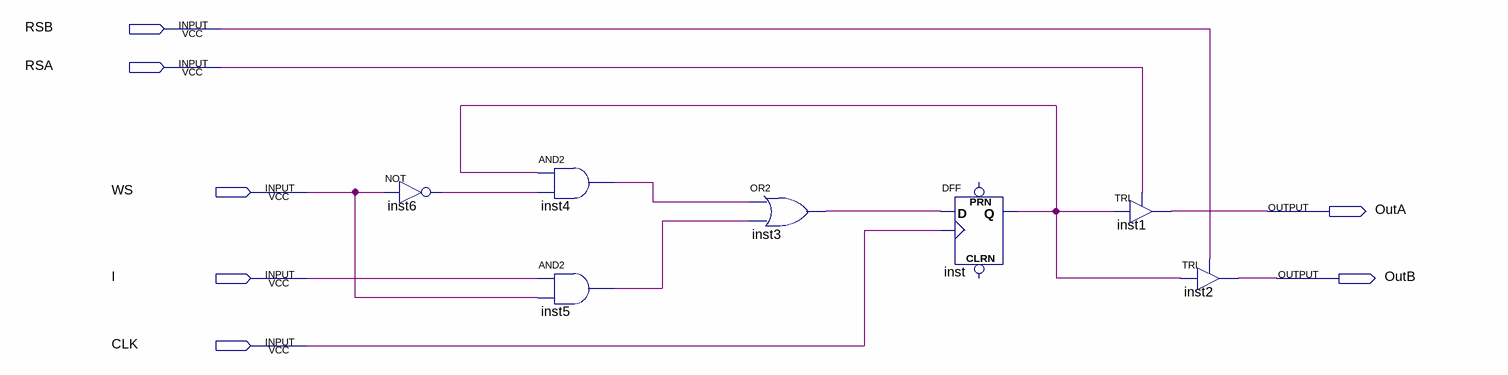
[diagram p0: schematic sheet]
// Quartus schematic RFC.bdf as structural Verilog: 7 symbols, 7 pins
module RFC (
  input  RSB,
  input  RSA,
  input  WS,
  input  I,
  input  CLK,
  output OutA,
  output OutB
);

  wire inst3_out, inst4_out, inst5_out, inst6_out, inst_q;

  not inst6 (inst6_out, WS);
  and inst4 (inst4_out, inst_q, inst6_out);
  and inst5 (inst5_out, I, WS);
  or inst3 (inst3_out, inst4_out, inst5_out);
  DFF inst (.CLK(CLK), .D(inst3_out), .Q(inst_q));  // open: CLRN, PRN
  TRI inst1 (.IN(inst_q), .OE(RSA), .OUT(OutA));
  TRI inst2 (.IN(inst_q), .OE(RSB), .OUT(OutB));
endmodule
